# Altium schematic sheet Sheet1.SchDoc (part 2 of 3)
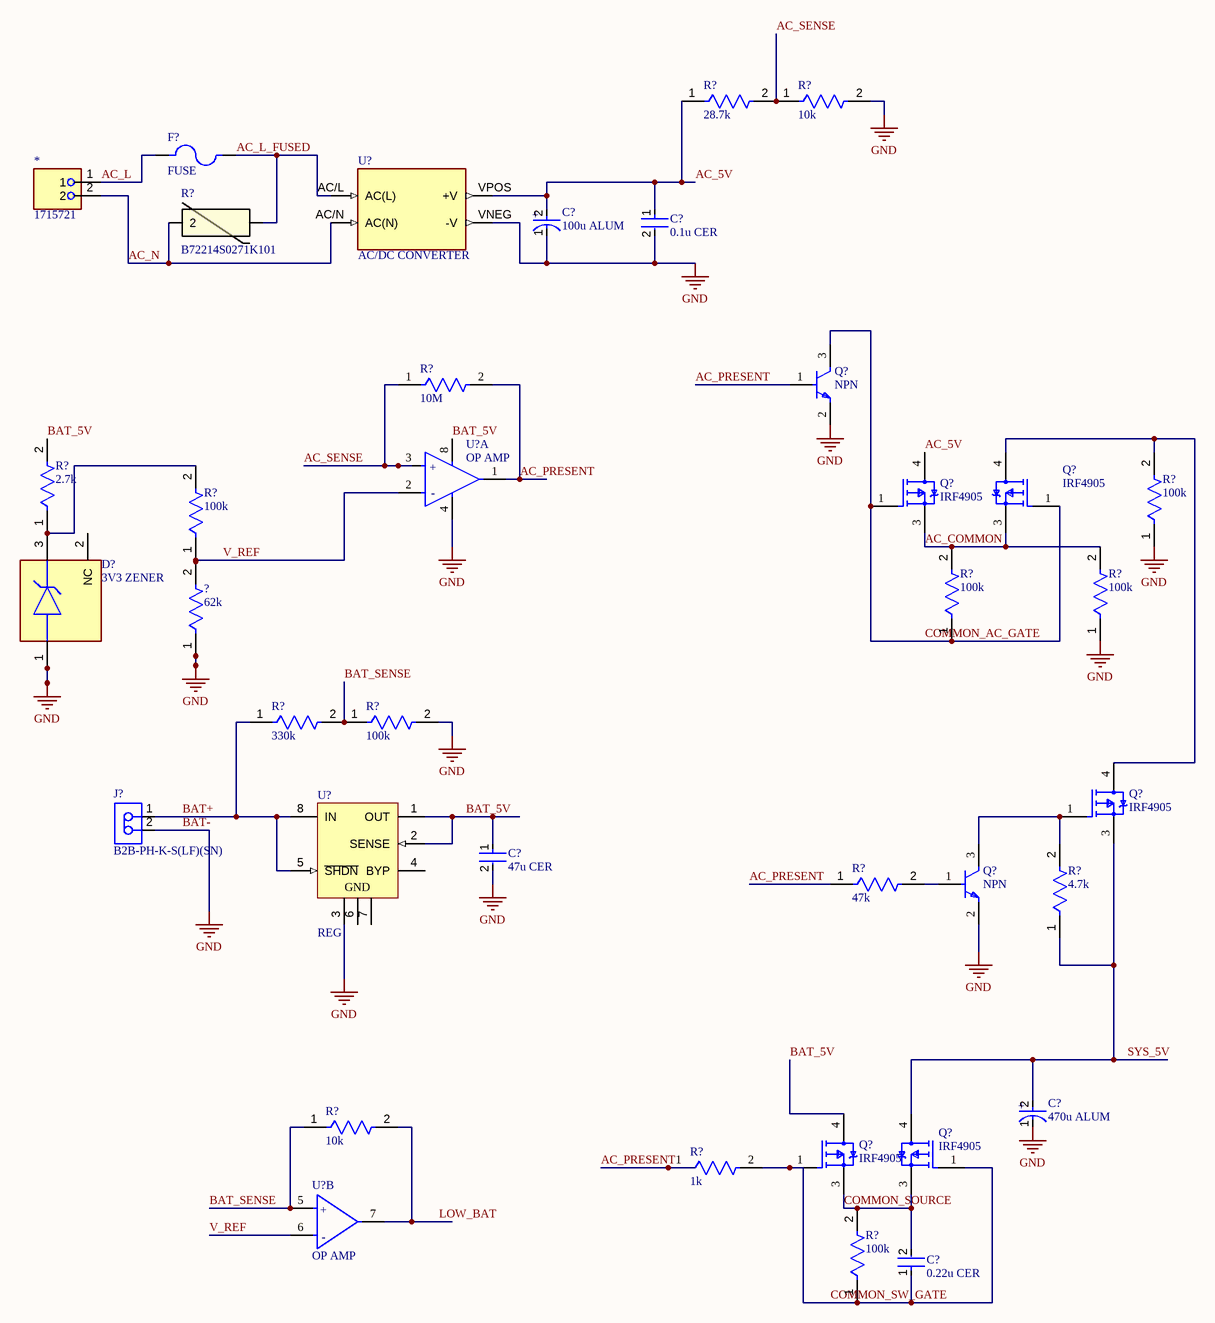
[diagram p1: Sheet1.SchDoc]
## Library data of the parts
* = 1715721: TERM BLK 2P SIDE ENT 5.08MM PCB; Manufacturer: Phoenix Contact; Manufacturer Lifecycle Status: AVAILABLE; Approvals: CSA, cUL; Connector Type: PCB, Screw, Terminal Block; Current: 15A; Current Rating: 17.5A; Max Current Rating: 22A; Max Supply Voltage: 250V; Number of Circuits: 2; Number of Levels: 1; Stripping Length: 7mm; Test Voltage: 4kV; Voltage: 300V; Voltage Rating: 400V; Wire/Cable Gauge: 14AWG; Wire Gauge (Max): 26AWG; Supplier: Arrow Electronics; Supplier Part Number: 1715721; Manufacturer Part Number: 1715721; RoHS: Compliant; Category: Terminal Blocks; Stock: 4066; Pricing: 1=1.109, 251=1.006 (USD); China RoHS: Compliant; Color: Green; Contact Material: Tin; Country of Origin: Germany; Depth: 9.8mm; Export Control Classification Number (ECCN) Code: EAR99; Flammability Rating: UL94 V-0; Height: 17.3mm; Housing Color: Green; Harmonized Tariff Schedule (HTS) Code: 8536.90.40.00; Insulation Material: Nylon; Introduction Date: 1998-01-15; Lead Free: Lead Free; Lead Pitch: 5.08mm; Length: 10.16mm; Lifecycle Status: Production; Max Operating Temperature: 100°C; Min Operating Temperature: -20°C; Mounting Technology: Screw; Number of Contacts: 2; Pins: 2; Number of Poles: 2; Number of Positions: 2; Number of Positions Per Level: 2; Number of Rows: 1; Orientation: Straight; Pitch: 5.08mm; Radiation Hardening: No; REACH SVHC: Unaffected; Termination: Screw; Voltage Rating (AC): 250V; Weight: 2.939987g; Width: 17.3mm; Wire Gauge (Min): 26AWG; ComponentLink1URL: https://datasheet.octopart.com:443/1715721-Phoenix-Contact-datasheet-195288929.pdf?src-supplier=Phoenix+Contact; ComponentLink1Description: https://datasheet.octopart.com:443/1715721-Phoenix-Contact-datasheet-195288929.pdf?src-supplier=Phoenix+Contact; ComponentLink2URL: https://sigma.octopart.com:443/195221700/technical_drawing/Phoenix-Contact-1715721.pdf?src-supplier=Phoenix+Contact; ComponentLink2Description: https://sigma.octopart.com:443/195221700/technical_drawing/Phoenix-Contact-1715721.pdf?src-supplier=Phoenix+Contact; ComponentLink3URL: https://datasheet.octopart.com:443/1715721-Phoenix-Contact-datasheet-62122377.pdf?src-supplier=Upverter; ComponentLink3Description: https://datasheet.octopart.com:443/1715721-Phoenix-Contact-datasheet-62122377.pdf?src-supplier=Upverter; ComponentLink4URL: https://datasheet.octopart.com:443/1715721-Phoenix-Contact-datasheet-181073212.pdf?src-supplier=IHS; ComponentLink4Description: https://datasheet.octopart.com:443/1715721-Phoenix-Contact-datasheet-181073212.pdf?src-supplier=IHS; ComponentLink5URL: https://datasheet.octopart.com:443/1715721-Phoenix-Contact-datasheet-66579234.pdf?src-supplier=Master+Electronics; ComponentLink5Description: https://datasheet.octopart.com:443/1715721-Phoenix-Contact-datasheet-66579234.pdf?src-supplier=Master+Electronics; ComponentLink6URL: https://datasheet.octopart.com:443/1715721-Phoenix-Contact-datasheet-14715205.pdf?src-supplier=Newark; ComponentLink6Description: https://datasheet.octopart.com:443/1715721-Phoenix-Contact-datasheet-14715205.pdf?src-supplier=Newark; ComponentLink7URL: https://datasheet.octopart.com:443/1715721-Phoenix-Contact-datasheet-499485.pdf?src-supplier=Newark; ComponentLink7Description: https://datasheet.octopart.com:443/1715721-Phoenix-Contact-datasheet-499485.pdf?src-supplier=Newark; ComponentLink8URL: https://datasheet.octopart.com:443/1715721-Phoenix-Contact-datasheet-154778360.pdf?src-supplier=Electro+Sonic; ComponentLink8Description: https://datasheet.octopart.com:443/1715721-Phoenix-Contact-datasheet-154778360.pdf?src-supplier=Electro+Sonic; ComponentLink9URL: https://datasheet.octopart.com:443/1715721-Phoenix-Contact-datasheet-9792235.pdf?src-supplier=TodayComponents; ComponentLink9Description: https://datasheet.octopart.com:443/1715721-Phoenix-Contact-datasheet-9792235.pdf?src-supplier=TodayComponents; ComponentLink10URL: https://datasheet.octopart.com:443/1715721-Phoenix-Contact-datasheet-166145896.pdf?src-supplier=Burklin+Elektronik; ComponentLink10Description: https://datasheet.octopart.com:443/1715721-Phoenix-Contact-datasheet-166145896.pdf?src-supplier=Burklin+Elektronik; ComponentLink11URL: https://datasheet.octopart.com:443/1715721-Phoenix-Contact-datasheet-33452854.pdf?src-supplier=MRO+Stop; ComponentLink11Description: https://datasheet.octopart.com:443/1715721-Phoenix-Contact-datasheet-33452854.pdf?src-supplier=MRO+Stop; ComponentLink12URL: https://datasheet.octopart.com:443/1715721-Phoenix-Contact-datasheet-8332660.pdf?src-supplier=Future+Electronics; ComponentLink12Description: https://datasheet.octopart.com:443/1715721-Phoenix-Contact-datasheet-8332660.pdf?src-supplier=Future+Electronics; ComponentLink13URL: https://datasheet.octopart.com:443/1715721-Phoenix-Contact-datasheet-19322.pdf?src-supplier=RS+(Formerly+Allied+Electronics); ComponentLink13Description: https://datasheet.octopart.com:443/1715721-Phoenix-Contact-datasheet-19322.pdf?src-supplier=RS+(Formerly+Allied+Electronics); ComponentLink14URL: https://datasheet.octopart.com:443/1715721-Phoenix-Contact-datasheet-84424.pdf?src-supplier=DigiKey; ComponentLink14Description: https://datasheet.octopart.com:443/1715721-Phoenix-Contact-datasheet-84424.pdf?src-supplier=DigiKey; ComponentLink15URL: http://sigma.octopart.com:80/195206437/materials_sheet/Phoenix-Contact-1715721.pdf?src-supplier=Compliance+Statements; ComponentLink15Description: http://sigma.octopart.com:80/195206437/materials_sheet/Phoenix-Contact-1715721.pdf?src-supplier=Compliance+Statements
? = CRCW080562K0FKEA: RES SMD 62K OHM 1% 1/8W 0805; Manufacturer: Vishay; Manufacturer Package Identifier: CRCW0805-e3; Power Rating: 125mW; Value: 62kΩ; Temperature Coefficient: 100ppm/°C; Voltage Rating: 150V; Supplier: Arrow Electronics; Supplier Part Number: CRCW080562K0FKEA; Manufacturer Part Number: CRCW080562K0FKEA; RoHS: Compliant; Category: Chip SMD Resistors; Stock: 9790; Pricing: 1=0.0045 (USD); Case/Package: 0805; Case Code (Imperial): 0805; China RoHS: Non-Compliant; Composition: Thick Film; Contact Plating: Tin; Depth: 1.25mm; Height: 450µm; Lead Free: Lead Free; Length: 2mm; Lifecycle Status: Production; Max Operating Temperature: 155°C; Military Standard: Not; Min Operating Temperature: -55°C; Mounting Technology: Surface Mount; Pins: 2; Number of Terminals: 2; Packaging: Cut Tape; Radiation Hardening: No; Ratings: AEC-Q200; REACH SVHC: Unaffected; Schedule B: 8533210045, 8533210045|8533210045|8533210045|8533210045|8533210045|8533210045|8533210045|8533210045|8533210045|8533210045|8533210045|8533210045|8533210045|8533210045|8533210045|8533210045|8533210045|8533210045|8533210045|8533210045|8533210045|8533210045|8533210045|85; Termination: SMD/SMT; Tolerance: 1%; Voltage Rating (DC): 150V; Weight: 5.499807mg; Width: 1.25mm; Working Voltage: 150V; ComponentLink1URL: https://datasheet.octopart.com:443/CRCW080562K0FKEA-Vishay-datasheet-175423584.pdf?src-supplier=IHS; ComponentLink1Description: https://datasheet.octopart.com:443/CRCW080562K0FKEA-Vishay-datasheet-175423584.pdf?src-supplier=IHS; ComponentLink2URL: https://datasheet.octopart.com:443/CRCW080562K0FKEA-Vishay-datasheet-83961561.pdf?src-supplier=Newark; ComponentLink2Description: https://datasheet.octopart.com:443/CRCW080562K0FKEA-Vishay-datasheet-83961561.pdf?src-supplier=Newark; ComponentLink3URL: https://datasheet.octopart.com:443/CRCW080562K0FKEA-Vishay-datasheet-11761042.pdf?src-supplier=Newark; ComponentLink3Description: https://datasheet.octopart.com:443/CRCW080562K0FKEA-Vishay-datasheet-11761042.pdf?src-supplier=Newark; ComponentLink4URL: https://datasheet.octopart.com:443/CRCW080562K0FKEA-Vishay-datasheet-11516975.pdf?src-supplier=Newark; ComponentLink4Description: https://datasheet.octopart.com:443/CRCW080562K0FKEA-Vishay-datasheet-11516975.pdf?src-supplier=Newark; ComponentLink5URL: https://datasheet.octopart.com:443/CRCW080562K0FKEA-Vishay-datasheet-41302739.pdf?src-supplier=Newark; ComponentLink5Description: https://datasheet.octopart.com:443/CRCW080562K0FKEA-Vishay-datasheet-41302739.pdf?src-supplier=Newark; ComponentLink6URL: https://datasheet.octopart.com:443/CRCW080562K0FKEA-Vishay-datasheet-27121962.pdf?src-supplier=Newark; ComponentLink6Description: https://datasheet.octopart.com:443/CRCW080562K0FKEA-Vishay-datasheet-27121962.pdf?src-supplier=Newark; ComponentLink7URL: https://datasheet.octopart.com:443/CRCW080562K0FKEA-Vishay-datasheet-66077789.pdf?src-supplier=element14+APAC; ComponentLink7Description: https://datasheet.octopart.com:443/CRCW080562K0FKEA-Vishay-datasheet-66077789.pdf?src-supplier=element14+APAC; ComponentLink8URL: https://datasheet.octopart.com:443/CRCW080562K0FKEA-Vishay-datasheet-62317937.pdf?src-supplier=element14+APAC; ComponentLink8Description: https://datasheet.octopart.com:443/CRCW080562K0FKEA-Vishay-datasheet-62317937.pdf?src-supplier=element14+APAC; ComponentLink9URL: https://datasheet.octopart.com:443/CRCW080562K0FKEA.-Vishay-datasheet-78776209.pdf?src-supplier=element14+APAC; ComponentLink9Description: https://datasheet.octopart.com:443/CRCW080562K0FKEA.-Vishay-datasheet-78776209.pdf?src-supplier=element14+APAC; ComponentLink10URL: https://datasheet.octopart.com:443/CRCW080562K0FKEA-Vishay-datasheet-14722531.pdf?src-supplier=element14+APAC; ComponentLink10Description: https://datasheet.octopart.com:443/CRCW080562K0FKEA-Vishay-datasheet-14722531.pdf?src-supplier=element14+APAC; ComponentLink11URL: https://datasheet.octopart.com:443/CRCW080562K0FKEA-Vishay-datasheet-31669108.pdf?src-supplier=Farnell; ComponentLink11Description: https://datasheet.octopart.com:443/CRCW080562K0FKEA-Vishay-datasheet-31669108.pdf?src-supplier=Farnell; ComponentLink12URL: https://datasheet.octopart.com:443/CRCW080562K0FKEA-Vishay-datasheet-159614168.pdf?src-supplier=JRH+Electronics; ComponentLink12Description: https://datasheet.octopart.com:443/CRCW080562K0FKEA-Vishay-datasheet-159614168.pdf?src-supplier=JRH+Electronics; ComponentLink13URL: https://datasheet.octopart.com:443/CRCW080562K0FKEA-Vishay-datasheet-62316122.pdf?src-supplier=Future+Electronics; ComponentLink13Description: https://datasheet.octopart.com:443/CRCW080562K0FKEA-Vishay-datasheet-62316122.pdf?src-supplier=Future+Electronics; ComponentLink14URL: https://datasheet.octopart.com:443/CRCW080562K0FKEA-Vishay-datasheet-12543454.pdf?src-supplier=Future+Electronics; ComponentLink14Description: https://datasheet.octopart.com:443/CRCW080562K0FKEA-Vishay-datasheet-12543454.pdf?src-supplier=Future+Electronics; ComponentLink15URL: https://datasheet.octopart.com:443/CRCW080562K0FKEA-Vishay-Dale-datasheet-47688880.pdf?src-supplier=RS+(Formerly+Allied+Electronics); ComponentLink15Description: https://datasheet.octopart.com:443/CRCW080562K0FKEA-Vishay-Dale-datasheet-47688880.pdf?src-supplier=RS+(Formerly+Allied+Electronics); ComponentLink16URL: https://datasheet.octopart.com:443/CRCW080562K0FKEA-Vishay-datasheet-8445837.pdf?src-supplier=element14; ComponentLink16Description: https://datasheet.octopart.com:443/CRCW080562K0FKEA-Vishay-datasheet-8445837.pdf?src-supplier=element14; ComponentLink17URL: http://sigma.octopart.com:80/rohs_statement/Vishay-company-15.pdf?src-supplier=Compliance+Statements; ComponentLink17Description: http://sigma.octopart.com:80/rohs_statement/Vishay-company-15.pdf?src-supplier=Compliance+Statements
C?#1 = EEEFT1C101AR: CAP ALUM 100UF 20% 16V SMD; Life (Hours): 2000Hour; Ripple Current: 240mA; Leakage Current: 16uA; Lead Diameter: 0.65mm; ESR (Equivalent Series Resistance): 360mR; Capacitance: 100uF; Voltage Rating: 16V; Lead Pitch: 1.5mm; RoHS Compliant: Yes; Mount: Surface Mount; Tolerance: 20%; Contact Plating: Tin; Length: 5.8mm; Voltage: 16V; REACH SVHC: No SVHC; Max Operating Temperature: 105°C; Series: FT; Min Operating Temperature: -55°C; Diameter: 5mm; Case/Package: Radial; Radiation Hardening: No; Height - Seated (Max): 0.24inch; Construction: Cylindrical; Packaging: Tape and Reel; Voltage Rating (DC): 16V; Termination: SMD/SMT; Package Quantity: 1000; Ripple Current (AC): 240mA; Height: 5.8mm
C?#2 = CL21B104KBCNNNC: CAP CER 0.1UF 50V X7R 0805; Tolerance: 10%; Material: Ceramic; Capacitance: 100nF; Depth: 1.25mm; Height: 0.85mm; Width: 0.049inch; Case Code (Metric): 2012; Case Code (Imperial): 0805; Thickness: 0.037inch; Min Operating Temperature: -55°C; Contact Plating: Tin; Length: 2mm; Mount: Surface Mount; Voltage Rating (DC): 50V; Lead Free: Lead Free; Dielectric: X7R; Radiation Hardening: No; Voltage Rating: 50V; Case/Package: 0805; Packaging: Tape and Reel; Max Operating Temperature: 125°C; Voltage: 50V
C?#3 = GRM21BR61A476ME15L: CAP CER 47UF 10V X5R 0805; Manufacturer: Murata; Manufacturer Lifecycle Status: IN PRODUCTION; Value: 47µF; Dielectric Material: Ceramic; Dissipation Factor: 0.035%; Tolerance: 20%; Supplier: Future Electronics; Supplier Part Number: GRM21BR61A476ME15L; Manufacturer Part Number: GRM21BR61A476ME15L; RoHS: Compliant; Category: Ceramic Capacitors; Stock: 548000; Pricing: 3000=0.715 (USD); Case/Package: 0805; Case Code (Imperial): 0805; Case Code (Metric): 2012; Country of Origin: Philippines; Depth: 1.25mm; Dielectric: X5R; Export Control Classification Number (ECCN) Code: EAR99; Height: 1.25mm; Harmonized Tariff Schedule (HTS) Code: 8532.24.00.20; Introduction Date: 2013-11-20; Lead Free: Lead Free; Length: 2mm; Lifecycle Status: Production; Material: Ceramic; Max Operating Temperature: 85°C; Min Operating Temperature: -55°C; Mounting Technology: Surface Mount; Number of Terminals: 2; Packaging: Cut Tape; REACH SVHC: Unaffected; Schedule B: 8532240020, 8532240020|8532240020, 8532240020|8532240020|8532240020, 8532240020|8532240020|8532240020|8532240020; Termination: SMD/SMT; Thickness: 1.25mm; Voltage: 10V; Voltage Rating: 10V; Voltage Rating (DC): 10V; Width: 1.25mm; ComponentLink1URL: https://datasheet.octopart.com:443/GRM21BR61A476ME15L-Murata-datasheet-22122223.pdf?src-supplier=Upverter; ComponentLink1Description: https://datasheet.octopart.com:443/GRM21BR61A476ME15L-Murata-datasheet-22122223.pdf?src-supplier=Upverter; ComponentLink2URL: https://datasheet.octopart.com:443/GRM21BR61A476ME15L-Murata-datasheet-66077109.pdf?src-supplier=element14+APAC; ComponentLink2Description: https://datasheet.octopart.com:443/GRM21BR61A476ME15L-Murata-datasheet-66077109.pdf?src-supplier=element14+APAC; ComponentLink3URL: https://datasheet.octopart.com:443/GRM21BR61A476ME15L-Murata-datasheet-141278181.pdf?src-supplier=Geoflip; ComponentLink3Description: https://datasheet.octopart.com:443/GRM21BR61A476ME15L-Murata-datasheet-141278181.pdf?src-supplier=Geoflip; ComponentLink4URL: https://datasheet.octopart.com:443/GRM21BR61A476ME15L-Murata-datasheet-165579666.pdf?src-supplier=TME; ComponentLink4Description: https://datasheet.octopart.com:443/GRM21BR61A476ME15L-Murata-datasheet-165579666.pdf?src-supplier=TME; ComponentLink5URL: https://datasheet.octopart.com:443/GRM21BR61A476ME15L-Murata-datasheet-59876780.pdf?src-supplier=TME; ComponentLink5Description: https://datasheet.octopart.com:443/GRM21BR61A476ME15L-Murata-datasheet-59876780.pdf?src-supplier=TME; ComponentLink6URL: https://datasheet.octopart.com:443/GRM21BR61A476ME15L-Murata-datasheet-140707527.pdf?src-supplier=Ciiva; ComponentLink6Description: https://datasheet.octopart.com:443/GRM21BR61A476ME15L-Murata-datasheet-140707527.pdf?src-supplier=Ciiva; ComponentLink7URL: https://datasheet.octopart.com:443/GRM21BR61A476ME15L-Murata-datasheet-138744839.pdf?src-supplier=Ciiva; ComponentLink7Description: https://datasheet.octopart.com:443/GRM21BR61A476ME15L-Murata-datasheet-138744839.pdf?src-supplier=Ciiva; ComponentLink8URL: https://datasheet.octopart.com/GRM21BR61A476ME15L-Murata-datasheet-12515295.pdf; ComponentLink8Description: https://datasheet.octopart.com/GRM21BR61A476ME15L-Murata-datasheet-12515295.pdf; ComponentLink9URL: https://datasheet.octopart.com/GRM21BR61A476ME15L-Murata-datasheet-12510076.pdf; ComponentLink9Description: https://datasheet.octopart.com/GRM21BR61A476ME15L-Murata-datasheet-12510076.pdf; ComponentLink10URL: https://datasheet.octopart.com/GRM21BR61A476ME15L-Murata-datasheet-11978611.pdf; ComponentLink10Description: https://datasheet.octopart.com/GRM21BR61A476ME15L-Murata-datasheet-11978611.pdf; ComponentLink11URL: https://datasheet.octopart.com/GRM21BR61A476ME15L-Murata-datasheet-10025737.pdf; ComponentLink11Description: https://datasheet.octopart.com/GRM21BR61A476ME15L-Murata-datasheet-10025737.pdf; ComponentLink12URL: https://datasheet.octopart.com/GRM21BR61A476ME15L-Murata-datasheet-8819587.pdf; ComponentLink12Description: https://datasheet.octopart.com/GRM21BR61A476ME15L-Murata-datasheet-8819587.pdf; ComponentLink13URL: http://sigma.octopart.com:80/reach_statement/Murata-company-16.pdf?src-supplier=Compliance+Statements; ComponentLink13Description: http://sigma.octopart.com:80/reach_statement/Murata-company-16.pdf?src-supplier=Compliance+Statements
C?#4 = EEEFK1A471P: CAP ALUM 470uF ±20% 10V SMD; Manufacturer: Panasonic; Manufacturer Lifecycle Status: ACTIVE; Part Series: FK; Value: 470µF; Dielectric Material: Aluminium; Dissipation Factor: 19%; ESR (Equivalent Series Resistance): 160mΩ; Leakage Current: 47µA; Life (Hours): 2000hours; Ripple Current: 600mA; Supplier: Avnet; Supplier Part Number: EEE-FK1A471P; Manufacturer Part Number: EEEFK1A471P; RoHS: Compliant; Category: Aluminum Electrolytic Capacitors; Stock: 4000; Pricing: 500=0.28647, 1000=0.27558, 2000=0.26534, 4000=0.25696, 8000=0.24826 (USD); Case/Package: 3333; Country of Origin: Japan, Malaysia; Diameter: 8mm; Export Control Classification Number (ECCN) Code: EAR99; Height: 10.2mm; Height - Seated (Max): 10.2108mm; Harmonized Tariff Schedule (HTS) Code: 8532.22.00.20; Impedance: 160mΩ; Introduction Date: 2004-08-25; Lead Free: Lead Free; Length: 10.2mm; Lifecycle Status: Production; Max Operating Temperature: 105°C; Min Operating Temperature: -55°C; Mounting Technology: Surface Mount; Pins: 2; Number of Terminals: 2; Packaging: Cut Tape; Radiation Hardening: No; Ratings: AEC-Q200; REACH SVHC: Unaffected; Ripple Current (AC): 600mA; Schedule B: 8532220020, 8532220020|8532220020|8532220020|8532220020|8532220020; Termination: SMD/SMT; Tolerance: 20%; Voltage: 10V; Voltage Rating: 10V; Voltage Rating (AC): 10V; Voltage Rating (DC): 10V; Width: 8.3mm; ComponentLink1URL: https://datasheet.octopart.com:443/EEEFK1A471P-Panasonic-datasheet-169278531.pdf?src-supplier=IHS; ComponentLink1Description: https://datasheet.octopart.com:443/EEEFK1A471P-Panasonic-datasheet-169278531.pdf?src-supplier=IHS; ComponentLink2URL: https://datasheet.octopart.com:443/EEEFK1A471P-Panasonic-datasheet-62287436.pdf?src-supplier=Future+Electronics; ComponentLink2Description: https://datasheet.octopart.com:443/EEEFK1A471P-Panasonic-datasheet-62287436.pdf?src-supplier=Future+Electronics; ComponentLink3URL: https://datasheet.octopart.com:443/EEEFK1A471P-Panasonic-datasheet-8854493.pdf?src-supplier=Future+Electronics; ComponentLink3Description: https://datasheet.octopart.com:443/EEEFK1A471P-Panasonic-datasheet-8854493.pdf?src-supplier=Future+Electronics; ComponentLink4URL: https://datasheet.octopart.com:443/EEEFK1A471P-Panasonic-datasheet-8711795.pdf?src-supplier=Future+Electronics; ComponentLink4Description: https://datasheet.octopart.com:443/EEEFK1A471P-Panasonic-datasheet-8711795.pdf?src-supplier=Future+Electronics; ComponentLink5URL: https://datasheet.octopart.com:443/EEEFK1A471P-Panasonic-datasheet-5313801.pdf?src-supplier=Future+Electronics; ComponentLink5Description: https://datasheet.octopart.com:443/EEEFK1A471P-Panasonic-datasheet-5313801.pdf?src-supplier=Future+Electronics; ComponentLink6URL: https://datasheet.octopart.com:443/EEEFK1A471P-Panasonic-datasheet-61627622.pdf?src-supplier=Newark; ComponentLink6Description: https://datasheet.octopart.com:443/EEEFK1A471P-Panasonic-datasheet-61627622.pdf?src-supplier=Newark; ComponentLink7URL: https://datasheet.octopart.com:443/EEEFK1A471P-Panasonic-datasheet-8161.pdf?src-supplier=Newark; ComponentLink7Description: https://datasheet.octopart.com:443/EEEFK1A471P-Panasonic-datasheet-8161.pdf?src-supplier=Newark; ComponentLink8URL: https://datasheet.octopart.com:443/EEEFK1A471P-Panasonic-datasheet-8852369.pdf?src-supplier=Newark; ComponentLink8Description: https://datasheet.octopart.com:443/EEEFK1A471P-Panasonic-datasheet-8852369.pdf?src-supplier=Newark; ComponentLink9URL: https://datasheet.octopart.com:443/EEEFK1A471P-Panasonic-datasheet-8712906.pdf?src-supplier=Newark; ComponentLink9Description: https://datasheet.octopart.com:443/EEEFK1A471P-Panasonic-datasheet-8712906.pdf?src-supplier=Newark; ComponentLink10URL: https://datasheet.octopart.com:443/EEEFK1A471P-Panasonic-datasheet-13278598.pdf?src-supplier=Newark; ComponentLink10Description: https://datasheet.octopart.com:443/EEEFK1A471P-Panasonic-datasheet-13278598.pdf?src-supplier=Newark; ComponentLink11URL: https://datasheet.octopart.com:443/EEE-FK1A471P-Panasonic-datasheet-159140467.pdf?src-supplier=Newark; ComponentLink11Description: https://datasheet.octopart.com:443/EEE-FK1A471P-Panasonic-datasheet-159140467.pdf?src-supplier=Newark; ComponentLink12URL: https://datasheet.octopart.com:443/EEE-FK1A471P-Panasonic-datasheet-22087609.pdf?src-supplier=Newark; ComponentLink12Description: https://datasheet.octopart.com:443/EEE-FK1A471P-Panasonic-datasheet-22087609.pdf?src-supplier=Newark; ComponentLink13URL: https://datasheet.octopart.com:443/EEE-FK1A471P-Panasonic-datasheet-150469824.pdf?src-supplier=JRH+Electronics; ComponentLink13Description: https://datasheet.octopart.com:443/EEE-FK1A471P-Panasonic-datasheet-150469824.pdf?src-supplier=JRH+Electronics; ComponentLink14URL: https://datasheet.octopart.com:443/EEEFK1A471P-Panasonic-datasheet-13266987.pdf?src-supplier=RS+(Formerly+Allied+Electronics); ComponentLink14Description: https://datasheet.octopart.com:443/EEEFK1A471P-Panasonic-datasheet-13266987.pdf?src-supplier=RS+(Formerly+Allied+Electronics); ComponentLink15URL: https://datasheet.octopart.com:443/EEE-FK1A471P-Panasonic-datasheet-11546739.pdf?src-supplier=Electro+Sonic; ComponentLink15Description: https://datasheet.octopart.com:443/EEE-FK1A471P-Panasonic-datasheet-11546739.pdf?src-supplier=Electro+Sonic; ComponentLink16URL: https://sigma.octopart.com:443/150570760/technical_drawing/Panasonic-EEEFK1A471P.pdf?src-supplier=Panasonic+SCT; ComponentLink16Description: https://sigma.octopart.com:443/150570760/technical_drawing/Panasonic-EEEFK1A471P.pdf?src-supplier=Panasonic+SCT; ComponentLink17URL: https://datasheet.octopart.com:443/EEEFK1A471P-Panasonic-datasheet-136531309.pdf?src-supplier=TME; ComponentLink17Description: https://datasheet.octopart.com:443/EEEFK1A471P-Panasonic-datasheet-136531309.pdf?src-supplier=TME; ComponentLink18URL: https://datasheet.octopart.com:443/EEEFK1A471P-Panasonic-datasheet-136348055.pdf?src-supplier=TME; ComponentLink18Description: https://datasheet.octopart.com:443/EEEFK1A471P-Panasonic-datasheet-136348055.pdf?src-supplier=TME; ComponentLink19URL: https://datasheet.octopart.com:443/EEEFK1A471P-Panasonic-datasheet-7555708.pdf?src-supplier=Farnell; ComponentLink19Description: https://datasheet.octopart.com:443/EEEFK1A471P-Panasonic-datasheet-7555708.pdf?src-supplier=Farnell; ComponentLink20URL: https://datasheet.octopart.com:443/EEEFK1A471P-Panasonic-datasheet-5318435.pdf?src-supplier=Farnell; ComponentLink20Description: https://datasheet.octopart.com:443/EEEFK1A471P-Panasonic-datasheet-5318435.pdf?src-supplier=Farnell; ComponentLink21URL: https://datasheet.octopart.com:443/EEEFK1A471P-Panasonic-datasheet-5316599.pdf?src-supplier=Farnell; ComponentLink21Description: https://datasheet.octopart.com:443/EEEFK1A471P-Panasonic-datasheet-5316599.pdf?src-supplier=Farnell; ComponentLink22URL: https://datasheet.octopart.com:443/EEEFK1A471P-Panasonic-datasheet-5390910.pdf?src-supplier=Farnell; ComponentLink22Description: https://datasheet.octopart.com:443/EEEFK1A471P-Panasonic-datasheet-5390910.pdf?src-supplier=Farnell; ComponentLink23URL: https://datasheet.octopart.com:443/EEEFK1A471P-Panasonic-datasheet-7550061.pdf?src-supplier=Farnell; ComponentLink23Description: https://datasheet.octopart.com:443/EEEFK1A471P-Panasonic-datasheet-7550061.pdf?src-supplier=Farnell; ComponentLink24URL: https://datasheet.octopart.com:443/EEEFK1A471P-Panasonic-datasheet-1770.pdf?src-supplier=Farnell; ComponentLink24Description: https://datasheet.octopart.com:443/EEEFK1A471P-Panasonic-datasheet-1770.pdf?src-supplier=Farnell; ComponentLink25URL: https://datasheet.octopart.com:443/EEEFK1A471P-Panasonic-datasheet-1290.pdf?src-supplier=Farnell; ComponentLink25Description: https://datasheet.octopart.com:443/EEEFK1A471P-Panasonic-datasheet-1290.pdf?src-supplier=Farnell; ComponentLink26URL: https://datasheet.octopart.com:443/EEEFK1A471P-Panasonic-datasheet-2601.pdf?src-supplier=Farnell; ComponentLink26Description: https://datasheet.octopart.com:443/EEEFK1A471P-Panasonic-datasheet-2601.pdf?src-supplier=Farnell; ComponentLink27URL: https://datasheet.octopart.com:443/EEEFK1A471P-Panasonic-datasheet-122249.pdf?src-supplier=Farnell; ComponentLink27Description: https://datasheet.octopart.com:443/EEEFK1A471P-Panasonic-datasheet-122249.pdf?src-supplier=Farnell; ComponentLink28URL: https://datasheet.octopart.com:443/EEEFK1A471P-Panasonic-datasheet-4056.pdf?src-supplier=Farnell; ComponentLink28Description: https://datasheet.octopart.com:443/EEEFK1A471P-Panasonic-datasheet-4056.pdf?src-supplier=Farnell
C?#5 = CC0805KRX7R6BB224: CAP CER 0.22UF 10V X7R 0805; Manufacturer: Yageo Group; Manufacturer Package Identifier: CC0805-0.85; Value: 220nF; Dielectric Material: Ceramic; Dissipation Factor: 5%; Insulation Resistance: 10GΩ; Tolerance: 10%; Supplier: DigiKey; Supplier Part Number: 311-4309-1-ND; Manufacturer Part Number: CC0805KRX7R6BB224; RoHS: Compliant; Category: Ceramic Capacitors; Stock: 33422; Pricing: 1=0.19, 10=0.109, 50=0.0768, 100=0.0669, 500=0.05016 (USD); Case/Package: 0805; Case Code (Imperial): 0805; Case Code (Metric): 2012; China RoHS: Compliant; Composition: Ceramic; Country of Origin: Mainland China, Taiwan; Depth: 1.25mm; Dielectric: X7R; Export Control Classification Number (ECCN) Code: EAR99; Halogen Free: Halogen Free; Height: 850µm; Harmonized Tariff Schedule (HTS) Code: 8532.24.00.20; Introduction Date: 2011-01-31; Lead Free: Lead Free; Length: 2mm; Lifecycle Status: Production; Material: Ceramic; Max Operating Temperature: 125°C; Min Operating Temperature: -55°C; Mounting Technology: Surface Mount; Number of Terminals: 2; Packaging: Tape and Reel; REACH SVHC: Unaffected; Termination: SMD/SMT; Thickness: 939.8µm; Voltage Rating: 10V; Voltage Rating (DC): 10V; Weight: 5.499807mg; Width: 1.25mm; ComponentLink1URL: https://datasheet.octopart.com:443/CC0805KRX7R6BB224-Yageo-datasheet-177165144.pdf?src-supplier=IHS; ComponentLink1Description: https://datasheet.octopart.com:443/CC0805KRX7R6BB224-Yageo-datasheet-177165144.pdf?src-supplier=IHS; ComponentLink2URL: https://datasheet.octopart.com:443/CC0805KRX7R6BB224-Yageo-datasheet-78855689.pdf?src-supplier=Upverter; ComponentLink2Description: https://datasheet.octopart.com:443/CC0805KRX7R6BB224-Yageo-datasheet-78855689.pdf?src-supplier=Upverter; ComponentLink3URL: https://datasheet.octopart.com/CC0805KRX7R6BB224-Yageo-datasheet-10883670.pdf; ComponentLink3Description: https://datasheet.octopart.com/CC0805KRX7R6BB224-Yageo-datasheet-10883670.pdf; ComponentLink4URL: https://datasheet.octopart.com:443/CC0805KRX7R6BB224-Yageo-Group-datasheet-184163374.pdf?src-supplier=LCSC; ComponentLink4Description: https://datasheet.octopart.com:443/CC0805KRX7R6BB224-Yageo-Group-datasheet-184163374.pdf?src-supplier=LCSC; ComponentLink5URL: https://datasheet.octopart.com:443/CC0805KRX7R6BB224-Yageo-datasheet-166511530.pdf?src-supplier=Future+Electronics; ComponentLink5Description: https://datasheet.octopart.com:443/CC0805KRX7R6BB224-Yageo-datasheet-166511530.pdf?src-supplier=Future+Electronics; ComponentLink6URL: https://datasheet.octopart.com:443/CC0805KRX7R6BB224-Yageo-datasheet-137700082.pdf?src-supplier=Future+Electronics; ComponentLink6Description: https://datasheet.octopart.com:443/CC0805KRX7R6BB224-Yageo-datasheet-137700082.pdf?src-supplier=Future+Electronics; ComponentLink7URL: https://datasheet.octopart.com:443/CC0805KRX7R6BB224-Yageo-datasheet-137700084.pdf?src-supplier=Future+Electronics; ComponentLink7Description: https://datasheet.octopart.com:443/CC0805KRX7R6BB224-Yageo-datasheet-137700084.pdf?src-supplier=Future+Electronics; ComponentLink8URL: https://datasheet.octopart.com:443/CC0805KRX7R6BB224-Yageo-datasheet-27626582.pdf?src-supplier=Future+Electronics; ComponentLink8Description: https://datasheet.octopart.com:443/CC0805KRX7R6BB224-Yageo-datasheet-27626582.pdf?src-supplier=Future+Electronics; ComponentLink9URL: https://datasheet.octopart.com:443/CC0805KRX7R6BB224-Yageo-datasheet-15895757.pdf?src-supplier=Future+Electronics; ComponentLink9Description: https://datasheet.octopart.com:443/CC0805KRX7R6BB224-Yageo-datasheet-15895757.pdf?src-supplier=Future+Electronics; ComponentLink10URL: https://datasheet.octopart.com:443/CC0805KRX7R6BB224-Yageo-datasheet-12526321.pdf?src-supplier=Future+Electronics; ComponentLink10Description: https://datasheet.octopart.com:443/CC0805KRX7R6BB224-Yageo-datasheet-12526321.pdf?src-supplier=Future+Electronics; ComponentLink11URL: https://datasheet.octopart.com:443/CC0805KRX7R6BB224-Yageo-Group-datasheet-165992755.pdf?src-supplier=ODG+(Origin+Data+Global); ComponentLink11Description: https://datasheet.octopart.com:443/CC0805KRX7R6BB224-Yageo-Group-datasheet-165992755.pdf?src-supplier=ODG+(Origin+Data+Global); ComponentLink12URL: http://sigma.octopart.com:80/conflict_mineral_statement/Yageo-company-3.pdf?src-supplier=Compliance+Statements; ComponentLink12Description: http://sigma.octopart.com:80/conflict_mineral_statement/Yageo-company-3.pdf?src-supplier=Compliance+Statements; ComponentLink13URL: http://sigma.octopart.com:80/rohs_statement/Yageo-company-2.pdf?src-supplier=Compliance+Statements; ComponentLink13Description: http://sigma.octopart.com:80/rohs_statement/Yageo-company-2.pdf?src-supplier=Compliance+Statements
D? = BZX84-C3V3,215: DIODE ZENER 3.3V 250MW TO236AB; Manufacturer: Nexperia; Manufacturer Lifecycle Status: RELEASED FOR SUPPLY; Element Configuration: Single; ESD Protection: No; Forward Current: 200mA; Forward Voltage: 900mV; Impedance: 95Ω; Max Junction Temperature (Tj): 150°C; Max Reverse Leakage Current: 5µA; Number of Elements: 1; Polarity: Unidirectional; Reverse Standoff Voltage: 1V; Test Current: 5mA; Tolerance: 5%; Supplier: Future Electronics; Supplier Part Number: BZX84-C3V3,215; Manufacturer Part Number: BZX84-C3V3,215; RoHS: Compliant; Category: Zener Diodes; Stock: 108000; Pricing: 3000=0.0267, 9000=0.0261, 30000=0.0254, 60000=0.025, 120000=0.0243 (USD); Ambient Temperature Range High: 150°C; Case/Package: SOT-23; China RoHS: Compliant; Composition: Zener; Contact Plating: Tin; Country of Origin: Mainland China; Export Control Classification Number (ECCN) Code: EAR99; Height: 1.1mm; Harmonized Tariff Schedule (HTS) Code: 8541.10.00.50; Introduction Date: 1999-05-18; Lead Free: Lead Free; Length: 3mm; Lifecycle Status: Production; Max Operating Temperature: 150°C; Max Power Dissipation: 250mW; Min Operating Temperature: -65°C; Mounting Technology: Surface Mount; Pins: 3; Number of Terminals: 3; Peak Reverse Current: 5µA; Power Dissipation: 250mW; Radiation Hardening: No; REACH SVHC: Unaffected; Reference Voltage: 3.3V; Reverse Voltage: 1V; Schedule B: 8541100050, 8541100050|8541100050|8541100050|8541100050|8541100050|8541100050|8541100050|8541100050|8541100050|8541100050|8541100050|8541100050|8541100050|8541100050|8541100050|8541100050|8541100050|8541100050|8541100050|8541100050|8541100050|8541100050|8541100050|85; Voltage Tolerance: 5%; Weight: 4.535924g; Width: 1.4mm; Working Voltage: 3.3V; Zener Current: 5mA; Zener Voltage: 3.3V; ComponentLink1URL: https://datasheet.octopart.com:443/BZX84-C3V3%2C215-Nexperia-datasheet-180923215.pdf?src-supplier=IHS; ComponentLink1Description: https://datasheet.octopart.com:443/BZX84-C3V3%2C215-Nexperia-datasheet-180923215.pdf?src-supplier=IHS; ComponentLink2URL: https://datasheet.octopart.com:443/BZX84-C3V3%2C215-Nexperia-datasheet-24570111.pdf?src-supplier=IHS; ComponentLink2Description: https://datasheet.octopart.com:443/BZX84-C3V3%2C215-Nexperia-datasheet-24570111.pdf?src-supplier=IHS; ComponentLink3URL: https://datasheet.octopart.com:443/BZX84-C3V3%2C215-Nexperia-datasheet-81885907.pdf?src-supplier=Newark; ComponentLink3Description: https://datasheet.octopart.com:443/BZX84-C3V3%2C215-Nexperia-datasheet-81885907.pdf?src-supplier=Newark; ComponentLink4URL: https://sigma.octopart.com:443/138797052/technical_drawing/Nexperia-BZX84-C3V3%2C215.pdf?src-supplier=Upverter; ComponentLink4Description: https://sigma.octopart.com:443/138797052/technical_drawing/Nexperia-BZX84-C3V3%2C215.pdf?src-supplier=Upverter; ComponentLink5URL: https://datasheet.octopart.com:443/BZX84-C3V3%2C215-NXP-Semiconductors-datasheet-8361847.pdf?src-supplier=TME; ComponentLink5Description: https://datasheet.octopart.com:443/BZX84-C3V3%2C215-NXP-Semiconductors-datasheet-8361847.pdf?src-supplier=TME; ComponentLink6URL: https://datasheet.octopart.com:443/BZX84-C3V3%2C215-Nexperia-datasheet-14490340.pdf?src-supplier=element14+APAC; ComponentLink6Description: https://datasheet.octopart.com:443/BZX84-C3V3%2C215-Nexperia-datasheet-14490340.pdf?src-supplier=element14+APAC; ComponentLink7URL: https://datasheet.octopart.com:443/BZX84-C3V3%2C215-Nexperia-datasheet-116120567.pdf?src-supplier=Farnell; ComponentLink7Description: https://datasheet.octopart.com:443/BZX84-C3V3%2C215-Nexperia-datasheet-116120567.pdf?src-supplier=Farnell; ComponentLink8URL: https://datasheet.octopart.com:443/BZX84-C3V3%2C215-Nexperia-datasheet-164870381.pdf?src-supplier=Burklin+Elektronik; ComponentLink8Description: https://datasheet.octopart.com:443/BZX84-C3V3%2C215-Nexperia-datasheet-164870381.pdf?src-supplier=Burklin+Elektronik; ComponentLink9URL: https://datasheet.octopart.com:443/BZX84-C3V3%2C215-NXP-Semiconductors-datasheet-7823842.pdf?src-supplier=Jameco+(USA); ComponentLink9Description: https://datasheet.octopart.com:443/BZX84-C3V3%2C215-NXP-Semiconductors-datasheet-7823842.pdf?src-supplier=Jameco+(USA); ComponentLink10URL: https://datasheet.octopart.com:443/BZX84-C3V3%2C215-NXP-datasheet-30538.pdf?src-supplier=Future+Electronics; ComponentLink10Description: https://datasheet.octopart.com:443/BZX84-C3V3%2C215-NXP-datasheet-30538.pdf?src-supplier=Future+Electronics; ComponentLink11URL: http://sigma.octopart.com:80/reach_statement/NXP-Semiconductors-company-13.pdf?src-supplier=Compliance+Statements; ComponentLink11Description: http://sigma.octopart.com:80/reach_statement/NXP-Semiconductors-company-13.pdf?src-supplier=Compliance+Statements; ComponentLink12URL: http://sigma.octopart.com:80/rohs_statement/NXP-Semiconductors-company-12.pdf?src-supplier=Compliance+Statements; ComponentLink12Description: http://sigma.octopart.com:80/rohs_statement/NXP-Semiconductors-company-12.pdf?src-supplier=Compliance+Statements
F? = 4628: FUSE HLDR CARTRIDGE 250V 5A PCB; Manufacturer: Keystone; Approvals: UL; Body Material: Nylon; Color: Black; Illumination Type: Illuminated; Material: Brass, Nylon, Tin; Number of Circuits: 1; Supplier: Future Electronics; Supplier Part Number: 4628; Manufacturer Part Number: 4628; RoHS: Compliant; Category: Fuse Holders; Stock: 3395; Pricing: 30=0.62, 100=0.605, 300=0.59, 1000=0.575, 3000=0.55 (USD); Contact Material: Brass; Contact Plating: Tin; Country of Origin: Italy; Current Rating: 5A; Depth: 9mm; Fuse Current: 5A; Introduction Date: 2008-01-24; Lead Free: Lead Free; Length: 24.2mm; Lifecycle Status: Production; Max Operating Temperature: 145°C; Min Operating Temperature: -50°C; Mounting Technology: Horizontal, PCB; Number of Poles: 1; Orientation: Horizontal; REACH SVHC: Unaffected; Termination: PC Pin; Voltage: 250V; Voltage Rating: 250V; Voltage Rating (AC): 250V; Voltage Rating (DC): 250V; Width: 9.52mm; ComponentLink1URL: https://datasheet.octopart.com:443/4628-Keystone-datasheet-15715941.pdf?src-supplier=Future+Electronics; ComponentLink1Description: https://datasheet.octopart.com:443/4628-Keystone-datasheet-15715941.pdf?src-supplier=Future+Electronics; ComponentLink2URL: https://datasheet.octopart.com:443/4628-Keystone-datasheet-3558.pdf?src-supplier=Future+Electronics; ComponentLink2Description: https://datasheet.octopart.com:443/4628-Keystone-datasheet-3558.pdf?src-supplier=Future+Electronics; ComponentLink3URL: https://datasheet.octopart.com:443/4628-Keystone-datasheet-68300138.pdf?src-supplier=Future+Electronics; ComponentLink3Description: https://datasheet.octopart.com:443/4628-Keystone-datasheet-68300138.pdf?src-supplier=Future+Electronics; ComponentLink4URL: https://datasheet.octopart.com:443/4628-Keystone-datasheet-110727089.pdf?src-supplier=Future+Electronics; ComponentLink4Description: https://datasheet.octopart.com:443/4628-Keystone-datasheet-110727089.pdf?src-supplier=Future+Electronics; ComponentLink5URL: https://datasheet.octopart.com:443/4628-Keystone-datasheet-536768.pdf?src-supplier=Future+Electronics; ComponentLink5Description: https://datasheet.octopart.com:443/4628-Keystone-datasheet-536768.pdf?src-supplier=Future+Electronics; ComponentLink6URL: https://datasheet.octopart.com:443/4628-Keystone-datasheet-21202851.pdf?src-supplier=Farnell; ComponentLink6Description: https://datasheet.octopart.com:443/4628-Keystone-datasheet-21202851.pdf?src-supplier=Farnell; ComponentLink7URL: https://datasheet.octopart.com:443/4628-Keystone-datasheet-15983575.pdf?src-supplier=Sager+Electronics; ComponentLink7Description: https://datasheet.octopart.com:443/4628-Keystone-datasheet-15983575.pdf?src-supplier=Sager+Electronics; ComponentLink8URL: https://datasheet.octopart.com:443/4628-Keystone-datasheet-7830329.pdf?src-supplier=RS+(Formerly+Allied+Electronics); ComponentLink8Description: https://datasheet.octopart.com:443/4628-Keystone-datasheet-7830329.pdf?src-supplier=RS+(Formerly+Allied+Electronics); ComponentLink9URL: https://datasheet.octopart.com:443/4628-Keystone-datasheet-37511814.pdf?src-supplier=RS+(Formerly+Allied+Electronics); ComponentLink9Description: https://datasheet.octopart.com:443/4628-Keystone-datasheet-37511814.pdf?src-supplier=RS+(Formerly+Allied+Electronics); ComponentLink10URL: https://datasheet.octopart.com:443/4628-Keystone-datasheet-57465.pdf?src-supplier=RS+(Formerly+Allied+Electronics); ComponentLink10Description: https://datasheet.octopart.com:443/4628-Keystone-datasheet-57465.pdf?src-supplier=RS+(Formerly+Allied+Electronics)
J? = B2B-PH-K-S(LF)(SN): CONN HEADER VERT 2POS 2MM; Manufacturer: JST; Style/Orientation: StraightHeader/Plug; No of Positions: 2; Pitch: 2mm; Datasheet Version: Nov-08; Datasheet URL: http://datasheet.octopart.com/B2B-PH-K-S%28LF%29%28SN%29-JST-datasheet-8324864.pdf; Manufacturer URL: http://www.jst.com/home2.html; Type: ShroudedHeader; Termination: Crimp
Q?#1 Q?#5 = BC847BW,115: TRANS NPN 45V 0.1A SOT-323; Manufacturer: Nexperia; Manufacturer Lifecycle Status: RELEASED FOR SUPPLY; Collector Base Voltage (VCBO): 50V; Collector Emitter Saturation Voltage: 400mV; Element Configuration: Single; Emitter Base Voltage (VEBO): 6V; Frequency: 100MHz; hFE Min: 200; Max Collector Current: 100mA; Max Junction Temperature (Tj): 150°C; Max Power Dissipation: 200mW; Number of Elements: 1; Supplier: Future Electronics; Supplier Part Number: BC847BW,115; Manufacturer Part Number: BC847BW,115; RoHS: Compliant; Category: BJTs; Stock: 927000; Pricing: 3000=0.0248, 9000=0.0242, 30000=0.0236, 60000=0.0233, 120000=0.0226 (USD); Ambient Temperature Range High: 150°C; Case/Package: SOT-323; China RoHS: Compliant; Collector Emitter Breakdown Voltage: 45V; Collector Emitter Voltage (VCEO): 45V; Contact Plating: Tin; Country of Origin: Mainland China, Malaysia; Export Control Classification Number (ECCN) Code: EAR99; Gain Bandwidth Product: 100MHz; Height: 1.1mm; Harmonized Tariff Schedule (HTS) Code: 8541.21.00.95; Introduction Date: 1997-09-01; Lead Free: Lead Free; Length: 2.2mm; Lifecycle Status: Production; Max Breakdown Voltage: 45V; Clock Frequency: 100MHz; Max Operating Temperature: 150°C; Min Operating Temperature: -65°C; Mounting Technology: Surface Mount; Pins: 3; Number of Terminals: 3; Packaging: Cut Tape; Polarity: NPN; Power Dissipation: 200mW; Radiation Hardening: No; REACH SVHC: Unaffected; Schedule B: 8541210080, 8541210080|8541210080|8541210080|8541210080|8541210080; Transition Frequency: 100MHz; Width: 1.35mm; ComponentLink1URL: https://datasheet.octopart.com:443/BC847BW%2C115-Nexperia-datasheet-180923431.pdf?src-supplier=IHS; ComponentLink1Description: https://datasheet.octopart.com:443/BC847BW%2C115-Nexperia-datasheet-180923431.pdf?src-supplier=IHS; ComponentLink2URL: https://datasheet.octopart.com:443/BC847BW%2C115-Nexperia-datasheet-103923196.pdf?src-supplier=Upverter; ComponentLink2Description: https://datasheet.octopart.com:443/BC847BW%2C115-Nexperia-datasheet-103923196.pdf?src-supplier=Upverter; ComponentLink3URL: https://sigma.octopart.com:443/138897295/technical_drawing/Nexperia-BC847BW%2C115.pdf?src-supplier=Upverter; ComponentLink3Description: https://sigma.octopart.com:443/138897295/technical_drawing/Nexperia-BC847BW%2C115.pdf?src-supplier=Upverter; ComponentLink4URL: https://datasheet.octopart.com:443/BC847BW%2C115-Nexperia-datasheet-160638900.pdf?src-supplier=Newark; ComponentLink4Description: https://datasheet.octopart.com:443/BC847BW%2C115-Nexperia-datasheet-160638900.pdf?src-supplier=Newark; ComponentLink5URL: https://datasheet.octopart.com:443/BC847BW%2C115-Nexperia-datasheet-33021882.pdf?src-supplier=Newark; ComponentLink5Description: https://datasheet.octopart.com:443/BC847BW%2C115-Nexperia-datasheet-33021882.pdf?src-supplier=Newark; ComponentLink6URL: https://datasheet.octopart.com:443/BC847BW%2C115-Nexperia-datasheet-11982477.pdf?src-supplier=Newark; ComponentLink6Description: https://datasheet.octopart.com:443/BC847BW%2C115-Nexperia-datasheet-11982477.pdf?src-supplier=Newark; ComponentLink7URL: https://datasheet.octopart.com:443/BC847BW%2C115-Nexperia-datasheet-164345414.pdf?src-supplier=Future+Electronics; ComponentLink7Description: https://datasheet.octopart.com:443/BC847BW%2C115-Nexperia-datasheet-164345414.pdf?src-supplier=Future+Electronics; ComponentLink8URL: https://datasheet.octopart.com:443/BC847BW%2C115-Nexperia-datasheet-87580896.pdf?src-supplier=Future+Electronics; ComponentLink8Description: https://datasheet.octopart.com:443/BC847BW%2C115-Nexperia-datasheet-87580896.pdf?src-supplier=Future+Electronics; ComponentLink9URL: https://datasheet.octopart.com:443/BC847BW%2C115-Nexperia-datasheet-81456218.pdf?src-supplier=Nexperia; ComponentLink9Description: https://datasheet.octopart.com:443/BC847BW%2C115-Nexperia-datasheet-81456218.pdf?src-supplier=Nexperia; ComponentLink10URL: https://datasheet.octopart.com:443/BC847BW%2C115-Nexperia-datasheet-5341283.pdf?src-supplier=_legacy+Avnet; ComponentLink10Description: https://datasheet.octopart.com:443/BC847BW%2C115-Nexperia-datasheet-5341283.pdf?src-supplier=_legacy+Avnet; ComponentLink11URL: https://datasheet.octopart.com:443/BC847BW%2C115-NXP-Semiconductors-datasheet-20734447.pdf?src-supplier=Farnell; ComponentLink11Description: https://datasheet.octopart.com:443/BC847BW%2C115-NXP-Semiconductors-datasheet-20734447.pdf?src-supplier=Farnell; ComponentLink12URL: http://sigma.octopart.com:80/reach_statement/NXP-Semiconductors-company-13.pdf?src-supplier=Compliance+Statements; ComponentLink12Description: http://sigma.octopart.com:80/reach_statement/NXP-Semiconductors-company-13.pdf?src-supplier=Compliance+Statements; ComponentLink13URL: http://sigma.octopart.com:80/rohs_statement/NXP-Semiconductors-company-12.pdf?src-supplier=Compliance+Statements; ComponentLink13Description: http://sigma.octopart.com:80/rohs_statement/NXP-Semiconductors-company-12.pdf?src-supplier=Compliance+Statements
Q?#2-Q?#4 Q?#6 Q?#7 = IRF4905STRLPBF: MOSFET P-CH 55V 42A D2PAK; Manufacturer: Infineon; Drain to Source Breakdown Voltage: -55V; Drain to Source Resistance: 20mΩ; Element Configuration: Single; Fall Time: 64ns; Gate to Source Voltage (Vgs): 20V; Input Capacitance: 3.5nF; Max Junction Temperature (Tj): 150°C; Max Power Dissipation: 170W; Nominal Vgs: 4V; Number of Channels: 1; Power Dissipation: 150W; Value: 20mΩ; Rise Time: 99ns; Turn-Off Delay Time: 51ns; Turn-On Delay Time: 20ns; Supplier: Future Electronics; Supplier Part Number: IRF4905STRLPBF; Manufacturer Part Number: IRF4905STRLPBF; RoHS: Compliant; Category: MOSFETs; Stock: 20800; Pricing: 800=2.4 (USD); Case/Package: D2PAK; China RoHS: Non-Compliant; Continuous Drain Current (ID): 42A; Country of Origin: Mainland China; Drain to Source Voltage (Vdss): -55V; Dual Supply Voltage: 55V; Export Control Classification Number (ECCN) Code: EAR99; Height: 5.084mm; Harmonized Tariff Schedule (HTS) Code: 8541.29.00.95; Introduction Date: 1996-07-26; Lead Free: Lead Free; Length: 10.67mm; Lifecycle Status: Production; Max Operating Temperature: 150°C; Min Breakdown Voltage: 55V; Min Operating Temperature: -55°C; Mounting Technology: Surface Mount; Number of Elements: 1; Pins: 3; Number of Terminals: 2; On-State Resistance: 20mΩ; Package Quantity: 800; Packaging: Cut Tape; Radiation Hardening: No; Rds On Max: 20mΩ; REACH SVHC: Affected; Schedule B: 8541290080, 8541290080|8541290080|8541290080|8541290080|8541290080|8541290080|8541290080|8541290080|8541290080|8541290080|8541290080|8541290080|8541290080|8541290080|8541290080|8541290080|8541290080|8541290080|8541290080|8541290080|8541290080|8541290080|8541290080|85; Termination: SMD/SMT; Threshold Voltage: 4V; Width: 9.65mm; ComponentLink1URL: https://datasheet.octopart.com:443/IRF4905STRLPBF-Infineon-datasheet-7823242.pdf?src-supplier=element14+APAC; ComponentLink1Description: https://datasheet.octopart.com:443/IRF4905STRLPBF-Infineon-datasheet-7823242.pdf?src-supplier=element14+APAC; ComponentLink2URL: https://datasheet.octopart.com:443/IRF4905STRLPBF-Infineon-datasheet-6397759.pdf?src-supplier=element14+APAC; ComponentLink2Description: https://datasheet.octopart.com:443/IRF4905STRLPBF-Infineon-datasheet-6397759.pdf?src-supplier=element14+APAC; ComponentLink3URL: https://datasheet.octopart.com:443/IRF4905STRLPBF-Infineon-datasheet-180067141.pdf?src-supplier=IHS; ComponentLink3Description: https://datasheet.octopart.com:443/IRF4905STRLPBF-Infineon-datasheet-180067141.pdf?src-supplier=IHS; ComponentLink4URL: https://datasheet.octopart.com:443/IRF4905STRLPBF-Infineon-datasheet-9781395.pdf?src-supplier=RS+(Formerly+Allied+Electronics); ComponentLink4Description: https://datasheet.octopart.com:443/IRF4905STRLPBF-Infineon-datasheet-9781395.pdf?src-supplier=RS+(Formerly+Allied+Electronics); ComponentLink5URL: https://datasheet.octopart.com:443/IRF4905STRLPBF-International-Rectifier-datasheet-8761984.pdf?src-supplier=Jameco+(USA); ComponentLink5Description: https://datasheet.octopart.com:443/IRF4905STRLPBF-International-Rectifier-datasheet-8761984.pdf?src-supplier=Jameco+(USA); ComponentLink6URL: https://datasheet.octopart.com:443/IRF4905STRLPBF-International-Rectifier-datasheet-14060552.pdf?src-supplier=iiiC; ComponentLink6Description: https://datasheet.octopart.com:443/IRF4905STRLPBF-International-Rectifier-datasheet-14060552.pdf?src-supplier=iiiC; ComponentLink7URL: http://sigma.octopart.com:80/conflict_mineral_statement/Infineon-company-51.pdf?src-supplier=Compliance+Statements; ComponentLink7Description: http://sigma.octopart.com:80/conflict_mineral_statement/Infineon-company-51.pdf?src-supplier=Compliance+Statements; ComponentLink8URL: http://sigma.octopart.com:80/reach_statement/International-Rectifier-company-55.pdf?src-supplier=Compliance+Statements; ComponentLink8Description: http://sigma.octopart.com:80/reach_statement/International-Rectifier-company-55.pdf?src-supplier=Compliance+Statements; ComponentLink9URL: http://sigma.octopart.com:80/rohs_statement/International-Rectifier-company-54.pdf?src-supplier=Compliance+Statements; ComponentLink9Description: http://sigma.octopart.com:80/rohs_statement/International-Rectifier-company-54.pdf?src-supplier=Compliance+Statements